# EAGLE schematic SVF_AC_Coupling (EAGLE 7.2.0)
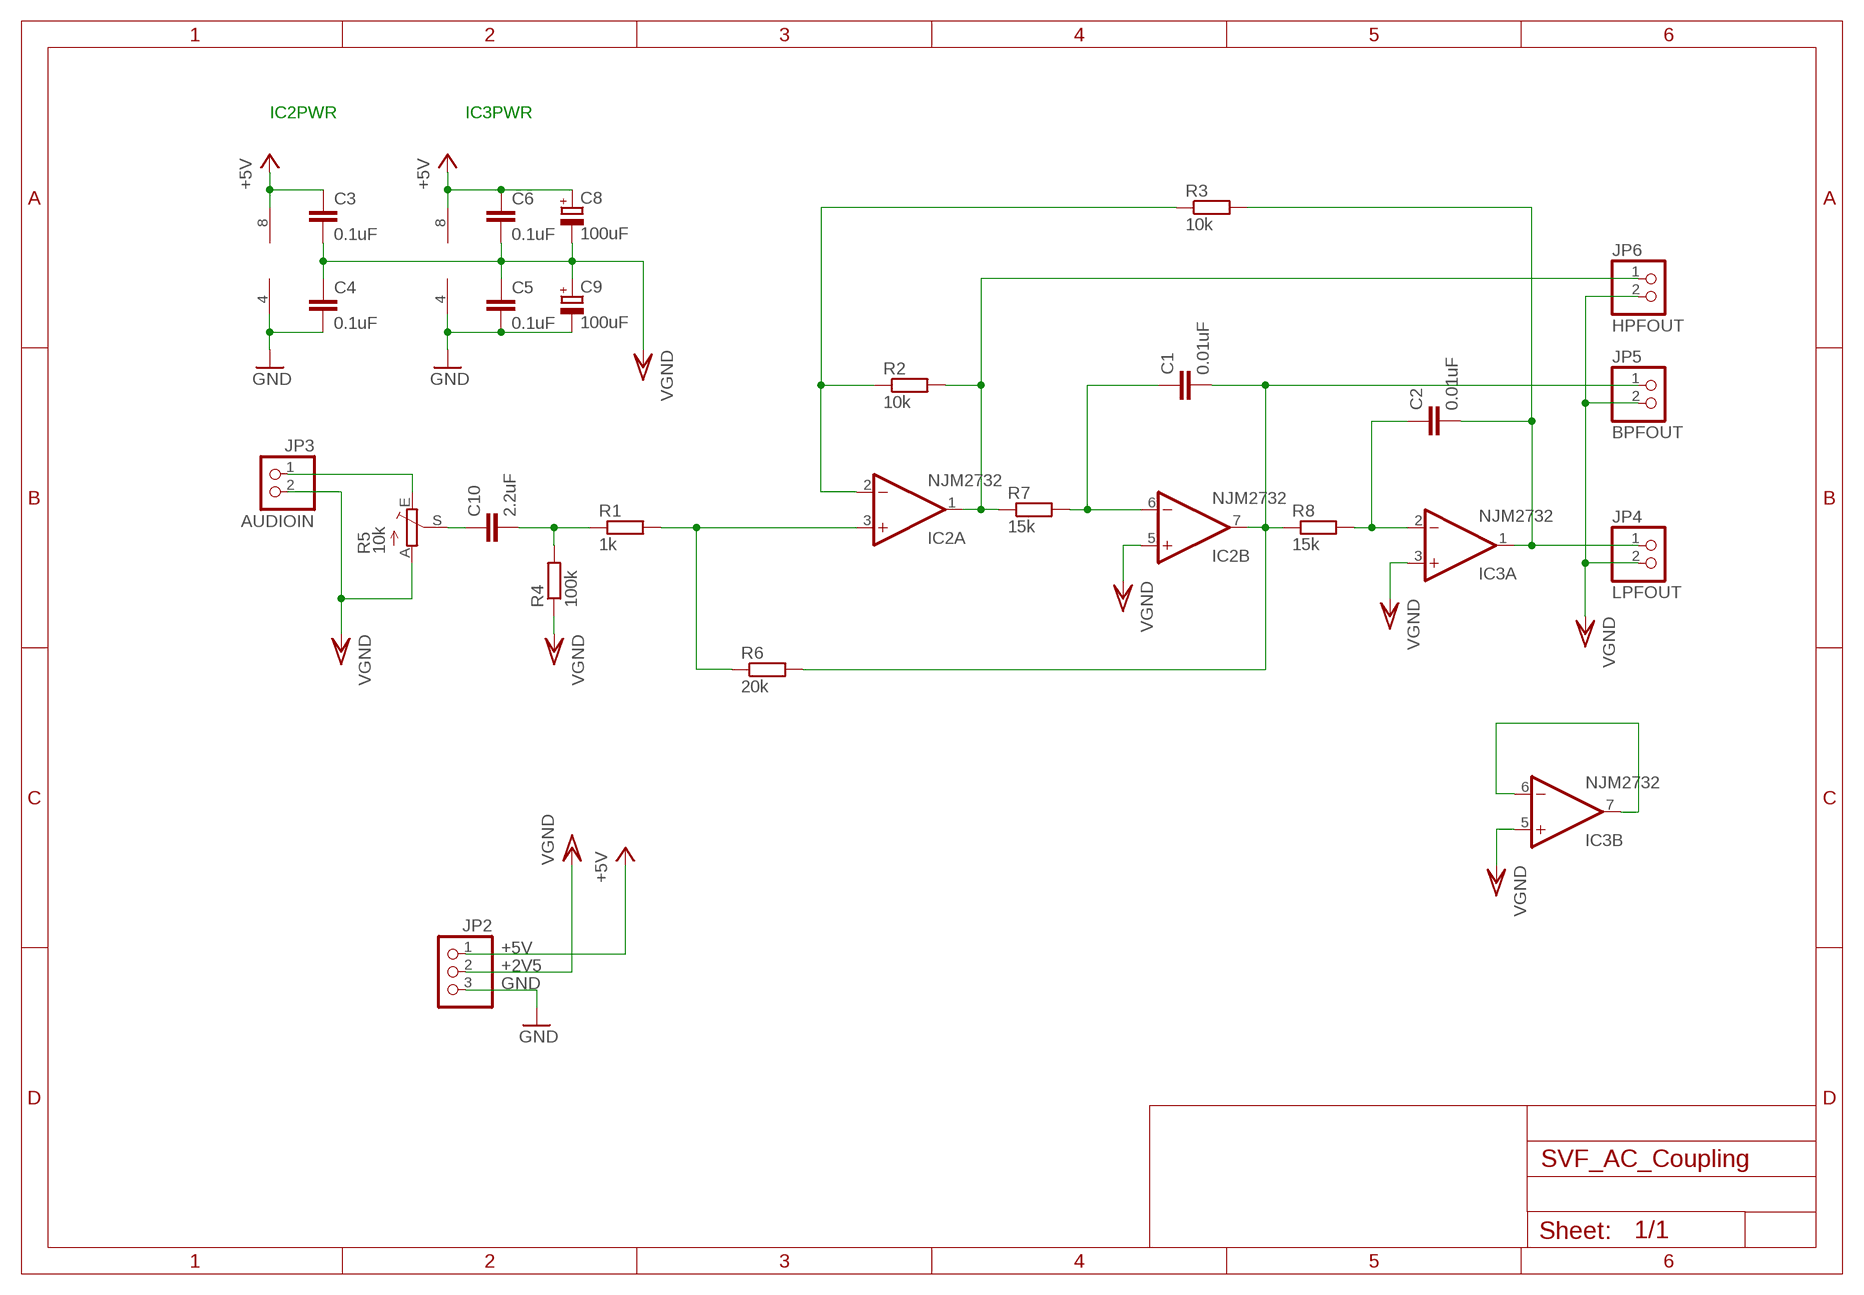
[diagram p0: schematic, sheet 1]

## Parts
C1  0.01uF  C-EU025-025X050  [C025-025X050]
C2  0.01uF  C-EU025-025X050  [C025-025X050]
C3  0.1uF  C-EU025-024X044  [C025-024X044]
C4  0.1uF  C-EU025-024X044  [C025-024X044]
C5  0.1uF  C-EU025-024X044  [C025-024X044]
C6  0.1uF  C-EU025-024X044  [C025-024X044]
C8  100uF  CPOL-EUE2.5-7  [E2,5-7]
C9  100uF  CPOL-EUE2.5-7  [E2,5-7]
C10  2.2uF  C-EU050-055X075  [C050-055X075]
IC2  NJM2732  LM4558N  [DIL08]
IC3  NJM2732  LM4558N  [DIL08]
JP2  PINHD-1X3  [1X03]
JP3  AUDIOIN  PINHD-1X2  [1X02]
JP4  LPFOUT  PINHD-1X2  [1X02]
JP5  BPFOUT  PINHD-1X2  [1X02]
JP6  HPFOUT  PINHD-1X2  [1X02]
R1  1k  R-EU_0207/7  [0207/7]
R2  10k  R-EU_0207/7  [0207/7]
R3  10k  R-EU_0207/7  [0207/7]
R4  100k  R-EU_0207/7  [0207/7]
R5  10k  TRIM_EU-B25P  [B25P]
R6  20k  R-EU_0207/7  [0207/7]
R7  15k  R-EU_0207/7  [0207/7]
R8  15k  R-EU_0207/7  [0207/7]

## Nets
+2V5: JP2.2 ; supply symbol labelled VGND
+5V: C3.1 C6.1 C8.+ IC2.8(P:V+) IC3.8(P:V+) JP2.1
GND: C4.2 C5.2 C9.- IC2.4(P:V-) IC3.4(P:V-) JP2.3
N$1: JP3.1 R5.E
N$2: C10.1 R5.S
N$3: IC2.3(A:+IN) R1.2 R6.1
N$4: IC2.2(A:-IN) R2.1 R3.1
N$5: IC2.1(A:OUT) JP6.1 R2.2 R7.1
N$7: C1.1 IC2.6(B:-IN) R7.2
N$8: IC3.6(B:-IN) IC3.7(B:OUT)
N$9: C2.2 IC3.1(A:OUT) JP4.1 R3.2
N$10: C1.2 IC2.7(B:OUT) JP5.1 R6.2 R8.1
N$11: C10.2 R1.1 R4.2
N$13: C2.1 IC3.2(A:-IN) R8.2
VCC/2: C3.2 C4.1 C5.1 C6.2 C8.- C9.+ IC2.5(B:+IN) IC3.3(A:+IN) IC3.5(B:+IN) JP3.2 JP4.2 JP5.2 JP6.2 R4.1 R5.A ; supply symbol labelled VGND

## Notes on the sheet
- IC2PWR | IC3PWR

## Library data of the parts
C1-C6 C10 = rcl:C-EU: CAPACITOR, European symbol
C8 C9 = rcl:CPOL-EU: POLARIZED CAPACITOR, European symbol
IC2 IC3 = linear:*4558: OP AMP
JP2 = pinhead:PINHD-1X3: PIN HEADER
JP3-JP6 = pinhead:PINHD-1X2: PIN HEADER
R1-R4 R6-R8 = rcl:R-EU_: RESISTOR, European symbol
R5 = pot:TRIM_EU-: POTENTIOMETER